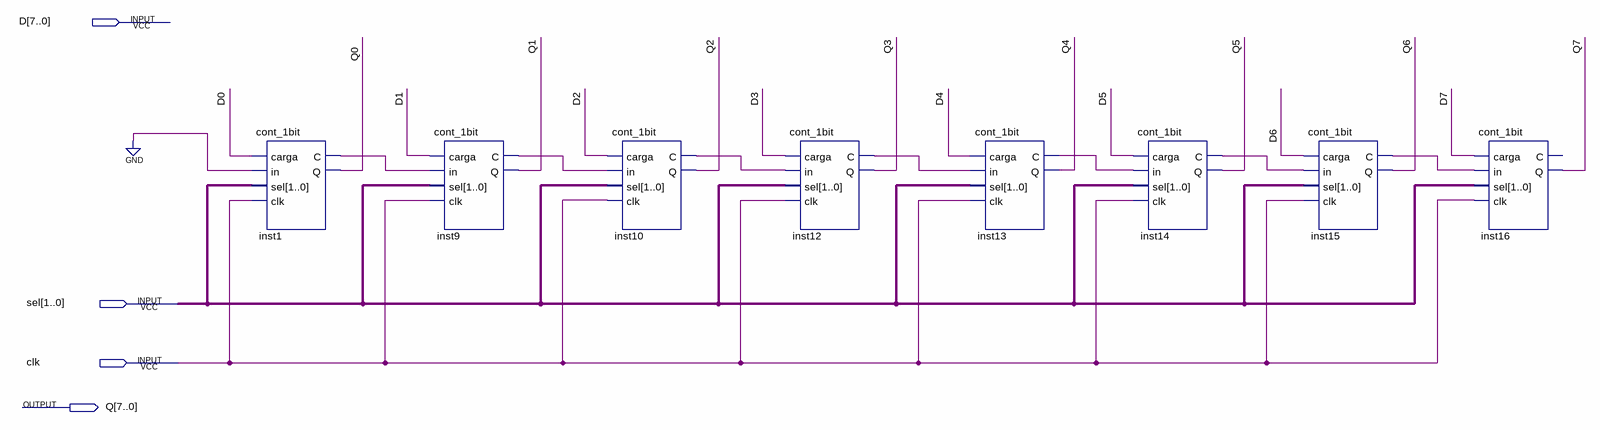
[diagram p0: schematic sheet]
// Quartus schematic contador.bdf as structural Verilog: 8 symbols, 4 pins
module contador (
  input  [7:0] D,
  input  [1:0] sel,
  input  clk,
  output [7:0] Q
);

  wire inst1_c, inst9_c, inst10_c, inst12_c, inst13_c, inst14_c, inst15_c;

  cont_1bit inst1 (.carga(D[0]), .in(1'b0), .sel(sel), .clk(clk), .C(inst1_c), .Q(Q[0]));
  cont_1bit inst9 (.carga(D[1]), .in(inst1_c), .sel(sel), .clk(clk), .C(inst9_c), .Q(Q[1]));
  cont_1bit inst10 (.carga(D[2]), .in(inst9_c), .sel(sel), .clk(clk), .C(inst10_c), .Q(Q[2]));
  cont_1bit inst12 (.carga(D[3]), .in(inst10_c), .sel(sel), .clk(clk), .C(inst12_c), .Q(Q[3]));
  cont_1bit inst13 (.carga(D[4]), .in(inst12_c), .sel(sel), .clk(clk), .C(inst13_c), .Q(Q[4]));
  cont_1bit inst14 (.carga(D[5]), .in(inst13_c), .sel(sel), .clk(clk), .C(inst14_c), .Q(Q[5]));
  cont_1bit inst15 (.carga(D[6]), .in(inst14_c), .sel(sel), .clk(clk), .C(inst15_c), .Q(Q[6]));
  cont_1bit inst16 (.carga(D[7]), .in(inst15_c), .sel(sel), .clk(clk), .Q(Q[7]));  // open: C
endmodule
